# Altium schematic sheet FPGAPower.SchDoc: {Наименование}
size 420 x 297 mm; DocumentNumber: ВКА.821011.000.ПЗ; PageSetup: Record=PageOptions|CenterHorizontal=False|CenterVertical=False|PrintScale=0.95|XCorrection=0.00|YCorrection=0.00|PrintKind=1|BorderSize=5000000|LeftOffset=0|BottomOffset=0|Orientation=1|PaperLength=1000|PaperWidth=1000|Scale=100|PaperSource=15|PrintQuality=600|MediaType=1|DitherType=10|PaperKind=A4|PrintScaleMode=1; Rule: PcbType=ProtelPcb
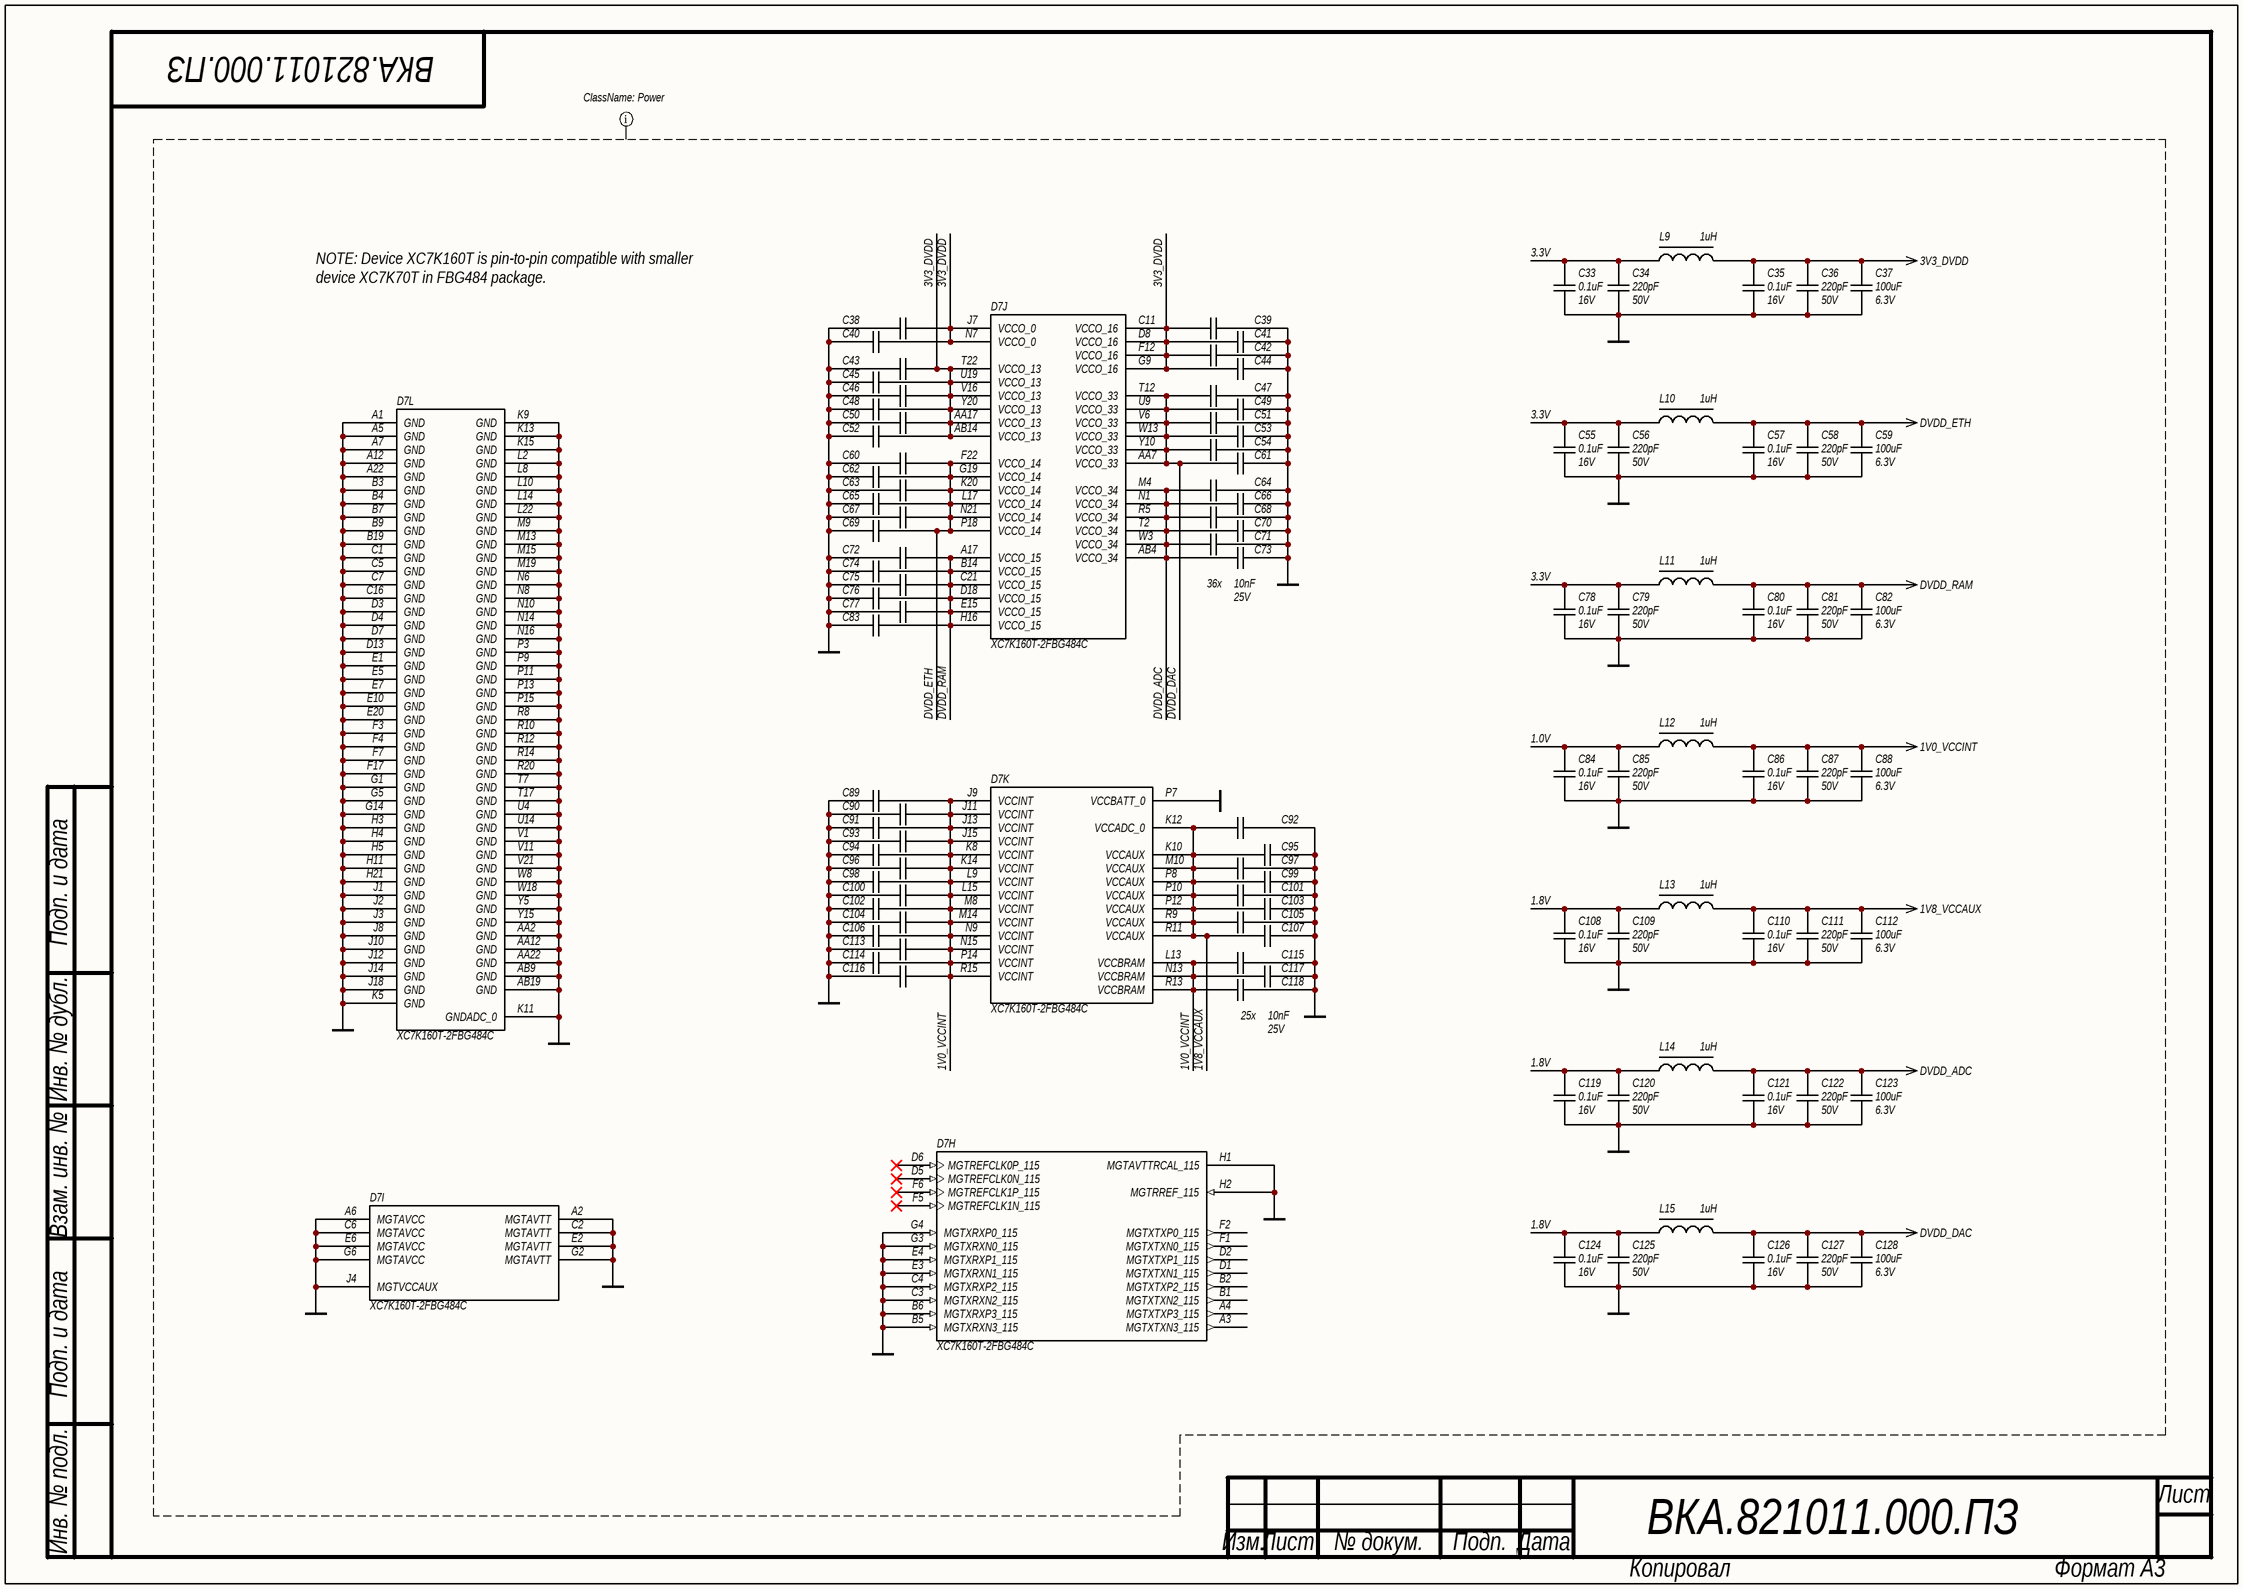
[diagram p0: FPGAPower.SchDoc]

## Parts
C33  value 0.1uF  Voltage: 16V  [C0603]  (hidden comment: CAP)
C34  value 220pF  Voltage: 50V  [C0603]  (hidden comment: CAP)
C35  value 0.1uF  Voltage: 16V  [C0603]  (hidden comment: CAP)
C36  value 220pF  Voltage: 50V  [C0603]  (hidden comment: CAP)
C37  value 100uF  Voltage: 6.3V  [C1210]  (hidden comment: CAP uF)
C38  CAP  [C0402]  (value not drawn)
C39  CAP  [C0402]  (value not drawn)
C40  CAP  [C0402]  (value not drawn)
C41  CAP  [C0402]  (value not drawn)
C42  CAP  [C0402]  (value not drawn)
C43  CAP  [C0402]  (value not drawn)
C44  CAP  [C0402]  (value not drawn)
C45  CAP  [C0402]  (value not drawn)
C46  CAP  [C0402]  (value not drawn)
C47  CAP  [C0402]  (value not drawn)
C48  CAP  [C0402]  (value not drawn)
C49  CAP  [C0402]  (value not drawn)
C50  CAP  [C0402]  (value not drawn)
C51  CAP  [C0402]  (value not drawn)
C52  CAP  [C0402]  (value not drawn)
C53  CAP  [C0402]  (value not drawn)
C54  CAP  [C0402]  (value not drawn)
C55  value 0.1uF  Voltage: 16V  [C0603]  (hidden comment: CAP)
C56  value 220pF  Voltage: 50V  [C0603]  (hidden comment: CAP)
C57  value 0.1uF  Voltage: 16V  [C0603]  (hidden comment: CAP)
C58  value 220pF  Voltage: 50V  [C0603]  (hidden comment: CAP)
C59  value 100uF  Voltage: 6.3V  [C1210]  (hidden comment: CAP uF)
C60  CAP  [C0402]  (value not drawn)
C61  CAP  [C0402]  (value not drawn)
C62  CAP  [C0402]  (value not drawn)
C63  CAP  [C0402]  (value not drawn)
C64  CAP  [C0402]  (value not drawn)
C65  CAP  [C0402]  (value not drawn)
C66  CAP  [C0402]  (value not drawn)
C67  CAP  [C0402]  (value not drawn)
C68  CAP  [C0402]  (value not drawn)
C69  CAP  [C0402]  (value not drawn)
C70  CAP  [C0402]  (value not drawn)
C71  CAP  [C0402]  (value not drawn)
C72  CAP  [C0402]  (value not drawn)
C73  value 10nF  Voltage: 25V  [C0402]  (hidden comment: CAP)
C74  CAP  [C0402]  (value not drawn)
C75  CAP  [C0402]  (value not drawn)
C76  CAP  [C0402]  (value not drawn)
C77  CAP  [C0402]  (value not drawn)
C78  value 0.1uF  Voltage: 16V  [C0603]  (hidden comment: CAP)
C79  value 220pF  Voltage: 50V  [C0603]  (hidden comment: CAP)
C80  value 0.1uF  Voltage: 16V  [C0603]  (hidden comment: CAP)
C81  value 220pF  Voltage: 50V  [C0603]  (hidden comment: CAP)
C82  value 100uF  Voltage: 6.3V  [C1210]  (hidden comment: CAP uF)
C83  CAP  [C0402]  (value not drawn)
C84  value 0.1uF  Voltage: 16V  [C0603]  (hidden comment: CAP)
C85  value 220pF  Voltage: 50V  [C0603]  (hidden comment: CAP)
C86  value 0.1uF  Voltage: 16V  [C0603]  (hidden comment: CAP)
C87  value 220pF  Voltage: 50V  [C0603]  (hidden comment: CAP)
C88  value 100uF  Voltage: 6.3V  [C1210]  (hidden comment: CAP uF)
C89  CAP  [C0402]  (value not drawn)
C90  CAP  [C0402]  (value not drawn)
C91  CAP  [C0402]  (value not drawn)
C92  CAP  [C0402]  (value not drawn)
C93  CAP  [C0402]  (value not drawn)
C94  CAP  [C0402]  (value not drawn)
C95  CAP  [C0402]  (value not drawn)
C96  CAP  [C0402]  (value not drawn)
C97  CAP  [C0402]  (value not drawn)
C98  CAP  [C0402]  (value not drawn)
C99  CAP  [C0402]  (value not drawn)
C100  CAP  [C0402]  (value not drawn)
C101  CAP  [C0402]  (value not drawn)
C102  CAP  [C0402]  (value not drawn)
C103  CAP  [C0402]  (value not drawn)
C104  CAP  [C0402]  (value not drawn)
C105  CAP  [C0402]  (value not drawn)
C106  CAP  [C0402]  (value not drawn)
C107  CAP  [C0402]  (value not drawn)
C108  value 0.1uF  Voltage: 16V  [C0603]  (hidden comment: CAP)
C109  value 220pF  Voltage: 50V  [C0603]  (hidden comment: CAP)
C110  value 0.1uF  Voltage: 16V  [C0603]  (hidden comment: CAP)
C111  value 220pF  Voltage: 50V  [C0603]  (hidden comment: CAP)
C112  value 100uF  Voltage: 6.3V  [C1210]  (hidden comment: CAP uF)
C113  CAP  [C0402]  (value not drawn)
C114  CAP  [C0402]  (value not drawn)
C115  CAP  [C0402]  (value not drawn)
C116  CAP  [C0402]  (value not drawn)
C117  CAP  [C0402]  (value not drawn)
C118  value 10nF  Voltage: 25V  [C0402]  (hidden comment: CAP)
C119  value 0.1uF  Voltage: 16V  [C0603]  (hidden comment: CAP)
C120  value 220pF  Voltage: 50V  [C0603]  (hidden comment: CAP)
C121  value 0.1uF  Voltage: 16V  [C0603]  (hidden comment: CAP)
C122  value 220pF  Voltage: 50V  [C0603]  (hidden comment: CAP)
C123  value 100uF  Voltage: 6.3V  [C1210]  (hidden comment: CAP uF)
C124  value 0.1uF  Voltage: 16V  [C0603]  (hidden comment: CAP)
C125  value 220pF  Voltage: 50V  [C0603]  (hidden comment: CAP)
C126  value 0.1uF  Voltage: 16V  [C0603]  (hidden comment: CAP)
C127  value 220pF  Voltage: 50V  [C0603]  (hidden comment: CAP)
C128  value 100uF  Voltage: 6.3V  [C1210]  (hidden comment: CAP uF)
D7  XC7K160T-2FBG484C  [FBG484]  (parts H,I,J,K,L of 12)
L9  value 1uH  [L1210_Murata LQH]  (hidden comment: Inductor LF)
L10  value 1uH  [L1210_Murata LQH]  (hidden comment: Inductor LF)
L11  value 1uH  [L1210_Murata LQH]  (hidden comment: Inductor LF)
L12  value 1uH  [L1210_Murata LQH]  (hidden comment: Inductor LF)
L13  value 1uH  [L1210_Murata LQH]  (hidden comment: Inductor LF)
L14  value 1uH  [L1210_Murata LQH]  (hidden comment: Inductor LF)
L15  value 1uH  [L1210_Murata LQH]  (hidden comment: Inductor LF)

## Nets
1V0_VCCINT: C86.2 C87.2 C88.2 C89.1 C90.1 C91.1 C93.1 C94.1 C96.1 C98.1 C100.1 C102.1 C104.1 C106.1 C113.1 C114.1 C115.2 C116.1 C117.2 C118.2 D7.J9(VCCINT) D7.J11(VCCINT) D7.J13(VCCINT) D7.J15(VCCINT) D7.K8(VCCINT) D7.K14(VCCINT) D7.L9(VCCINT) D7.L13(VCCBRAM) D7.L15(VCCINT) D7.M8(VCCINT) D7.M14(VCCINT) D7.N9(VCCINT) D7.N13(VCCBRAM) D7.N15(VCCINT) D7.P14(VCCINT) D7.R13(VCCBRAM) D7.R15(VCCINT) L12.2
1V8_VCCAUX: C92.2 C95.2 C97.2 C99.2 C101.2 C103.2 C105.2 C107.2 C110.2 C111.2 C112.2 D7.K10(VCCAUX) D7.K12(VCCADC_0) D7.M10(VCCAUX) D7.P8(VCCAUX) D7.P10(VCCAUX) D7.P12(VCCAUX) D7.R9(VCCAUX) D7.R11(VCCAUX) L13.2
3V3_DVDD: C35.2 C36.2 C37.2 C38.1 C39.2 C40.1 C41.2 C42.2 C43.1 C44.2 C45.1 C46.1 C48.1 C50.1 C52.1 D7.AA17(VCCO_13) D7.AB14(VCCO_13) D7.C11(VCCO_16) D7.D8(VCCO_16) D7.F12(VCCO_16) D7.G9(VCCO_16) D7.J7(VCCO_0) D7.N7(VCCO_0) D7.T22(VCCO_13) D7.U19(VCCO_13) D7.V16(VCCO_13) D7.Y20(VCCO_13) L9.2
DVDD_ADC: C64.2 C66.2 C68.2 C70.2 C71.2 C73.2 C121.2 C122.2 C123.2 D7.AB4(VCCO_34) D7.M4(VCCO_34) D7.N1(VCCO_34) D7.R5(VCCO_34) D7.T2(VCCO_34) D7.W3(VCCO_34) L14.2
DVDD_DAC: C47.2 C49.2 C51.2 C53.2 C54.2 C61.2 C126.2 C127.2 C128.2 D7.AA7(VCCO_33) D7.T12(VCCO_33) D7.U9(VCCO_33) D7.V6(VCCO_33) D7.W13(VCCO_33) D7.Y10(VCCO_33) L15.2
DVDD_ETH: C57.2 C58.2 C59.2 C60.1 C62.1 C63.1 C65.1 C67.1 C69.1 D7.F22(VCCO_14) D7.G19(VCCO_14) D7.K20(VCCO_14) D7.L17(VCCO_14) D7.N21(VCCO_14) D7.P18(VCCO_14) L10.2
DVDD_RAM: C72.1 C74.1 C75.1 C76.1 C77.1 C80.2 C81.2 C82.2 C83.1 D7.A17(VCCO_15) D7.B14(VCCO_15) D7.C21(VCCO_15) D7.D18(VCCO_15) D7.E15(VCCO_15) D7.H16(VCCO_15) L11.2
GND: C33.1 C34.1 C35.1 C36.1 C37.1 C38.2 C39.1 C40.2 C41.1 C42.1 C43.2 C44.1 C45.2 C46.2 C47.1 C48.2 C49.1 C50.2 C51.1 C52.2 C53.1 C54.1 C55.1 C56.1 C57.1 C58.1 C59.1 C60.2 C61.1 C62.2 C63.2 C64.1 C65.2 C66.1 C67.2 C68.1 C69.2 C70.1 C71.1 C72.2 C73.1 C74.2 C75.2 C76.2 C77.2 C78.1 C79.1 C80.1 C81.1 C82.1 C83.2 C84.1 C85.1 C86.1 C87.1 C88.1 C89.2 C90.2 C91.2 C92.1 C93.2 C94.2 C95.1 C96.2 C97.1 C98.2 C99.1 C100.2 C101.1 C102.2 C103.1 C104.2 C105.1 C106.2 C107.1 C108.1 C109.1 C110.1 C111.1 C112.1 C113.2 C114.2 C115.1 C116.2 C117.1 C118.1 C119.1 C120.1 C121.1 C122.1 C123.1 C124.1 C125.1 C126.1 C127.1 C128.1 D7.A1(GND) D7.A2(MGTAVTT) D7.A5(GND) D7.A6(MGTAVCC) D7.A7(GND) D7.A12(GND) D7.A22(GND) D7.AA2(GND) D7.AA12(GND) D7.AA22(GND) D7.AB9(GND) D7.AB19(GND) D7.B3(GND) D7.B4(GND) D7.B5(MGTXRXN3_115) D7.B6(MGTXRXP3_115) D7.B7(GND) D7.B9(GND) D7.B19(GND) D7.C1(GND) D7.C2(MGTAVTT) D7.C3(MGTXRXN2_115) D7.C4(MGTXRXP2_115) D7.C5(GND) D7.C6(MGTAVCC) D7.C7(GND) D7.C16(GND) D7.D3(GND) D7.D4(GND) D7.D7(GND) D7.D13(GND) D7.E1(GND) D7.E2(MGTAVTT) D7.E3(MGTXRXN1_115) D7.E4(MGTXRXP1_115) D7.E5(GND) D7.E6(MGTAVCC) D7.E7(GND) D7.E10(GND) D7.E20(GND) D7.F3(GND) D7.F4(GND) D7.F7(GND) D7.F17(GND) D7.G1(GND) D7.G2(MGTAVTT) D7.G3(MGTXRXN0_115) D7.G4(MGTXRXP0_115) D7.G5(GND) D7.G6(MGTAVCC) D7.G14(GND) D7.H1(MGTAVTTRCAL_115) D7.H2(MGTRREF_115) D7.H3(GND) D7.H4(GND) D7.H5(GND) D7.H11(GND) D7.H21(GND) D7.J1(GND) D7.J2(GND) D7.J3(GND) D7.J4(MGTVCCAUX) D7.J8(GND) D7.J10(GND) D7.J12(GND) D7.J14(GND) D7.J18(GND) D7.K5(GND) D7.K9(GND) D7.K11(GNDADC_0) D7.K13(GND) D7.K15(GND) D7.L2(GND) D7.L8(GND) D7.L10(GND) D7.L14(GND) D7.L22(GND) D7.M9(GND) D7.M13(GND) D7.M15(GND) D7.M19(GND) D7.N6(GND) D7.N8(GND) D7.N10(GND) D7.N14(GND) D7.N16(GND) D7.P3(GND) D7.P7(VCCBATT_0) D7.P9(GND) D7.P11(GND) D7.P13(GND) D7.P15(GND) D7.R8(GND) D7.R10(GND) D7.R12(GND) D7.R14(GND) D7.R20(GND) D7.T7(GND) D7.T17(GND) D7.U4(GND) D7.U14(GND) D7.V1(GND) D7.V11(GND) D7.V21(GND) D7.W8(GND) D7.W18(GND) D7.Y5(GND) D7.Y15(GND)
1.0V: C84.2 C85.2 L12.1
1.8V: C108.2 C109.2 C119.2 C120.2 C124.2 C125.2 L13.1 L14.1 L15.1
3.3V: C33.2 C34.2 C55.2 C56.2 C78.2 C79.2 L9.1 L10.1 L11.1

Not connected (* = marked no-connect by the designer): D7 A3(MGTXTXN3_115) A4(MGTXTXP3_115) B1(MGTXTXN2_115) B2(MGTXTXP2_115) D1(MGTXTXN1_115) D2(MGTXTXP1_115) D5(MGTREFCLK0N_115)* D6(MGTREFCLK0P_115)* F1(MGTXTXN0_115) F2(MGTXTXP0_115) F5(MGTREFCLK1N_115)* F6(MGTREFCLK1P_115)*

## Layout directives
net class Power: 1.0V, 1.8V, 1V0_VCCINT, 1V8_VCCAUX, 3.3V, 3V3_DVDD, DVDD_ADC, DVDD_DAC, DVDD_ETH, DVDD_RAM, GND

## Notes on the sheet
- NOTE: Device XC7K160T is pin-to-pin compatible with smaller device XC7K70T in FBG484 package.
- 36x
- 25x
- Подп. и дата
- Инв. № дубл.
- Взам. инв. №
- Инв. № подл.
- Лист
- Изм.
- № докум.
- Подп.
- Дата
- Копировал
- Формат А3

## Library data of the parts
C33 C35 C55 C57 C78 C80 C84 C86 C108 C110 C119 C121 C124 C126 = CAP: SMD Capacitor; Manufacturer: Murata; Material: X7R; Tolerance: 10%; Type: Ceramic Capacitor; P/N: GRM188R71C104KA01D
C34 C36 C56 C58 C79 C81 C85 C87 C109 C111 C120 C122 C125 C127 = CAP: SMD Capacitor; Manufacturer: Murata; Material: X7R; Tolerance: 10%; Type: Ceramic Capacitor; P/N: GRM188R71H221KA01D
C37 C59 C82 C88 C112 C123 C128 = CAP uF: SMD Capacitor; Manufacturer: Murata; Material: X5R; Tolerance: 20%; Type: Ceramic Capacitor; P/N: GRM32ER60J107ME20L
C38-C54 C60-C72 C74-C77 C83 C89-C107 C113-C117 = CAP: SMD Capacitor; Manufacturer: Murata; Material: X7R; Tolerance: 10%; Voltage: 25V; Type: Ceramic Capacitor; Value: 10nF; P/N: GRM155R71E103KA01D
C73 C118 = CAP: SMD Capacitor; Manufacturer: Murata; Material: X7R; Tolerance: 10%; Type: Ceramic Capacitor; P/N: GRM155R71E103KA01D
D7 = XC7K160T-2FBG484C: Xilinx 7-Series FPGA; Speed Grade: -2; Manufacturer: Xilinx; Name: XC7K160T-2FBG484C; Series: 7-Series FPGA; Package: 484 Ball FBG
L9-L15 = Inductor LF: Inductor Power Lines; Manufacturer: Murata; Name: LQH32PN1R0NNC; Current: 2500mA; Tolerance: 5%; Frequency: 100MHz; Temperature Range: -25ºC to 85ºC; Series: LQH; P/N: LQH32PN1R0NNC